# EAGLE design ChargeModule (EAGLE 9.6.2)
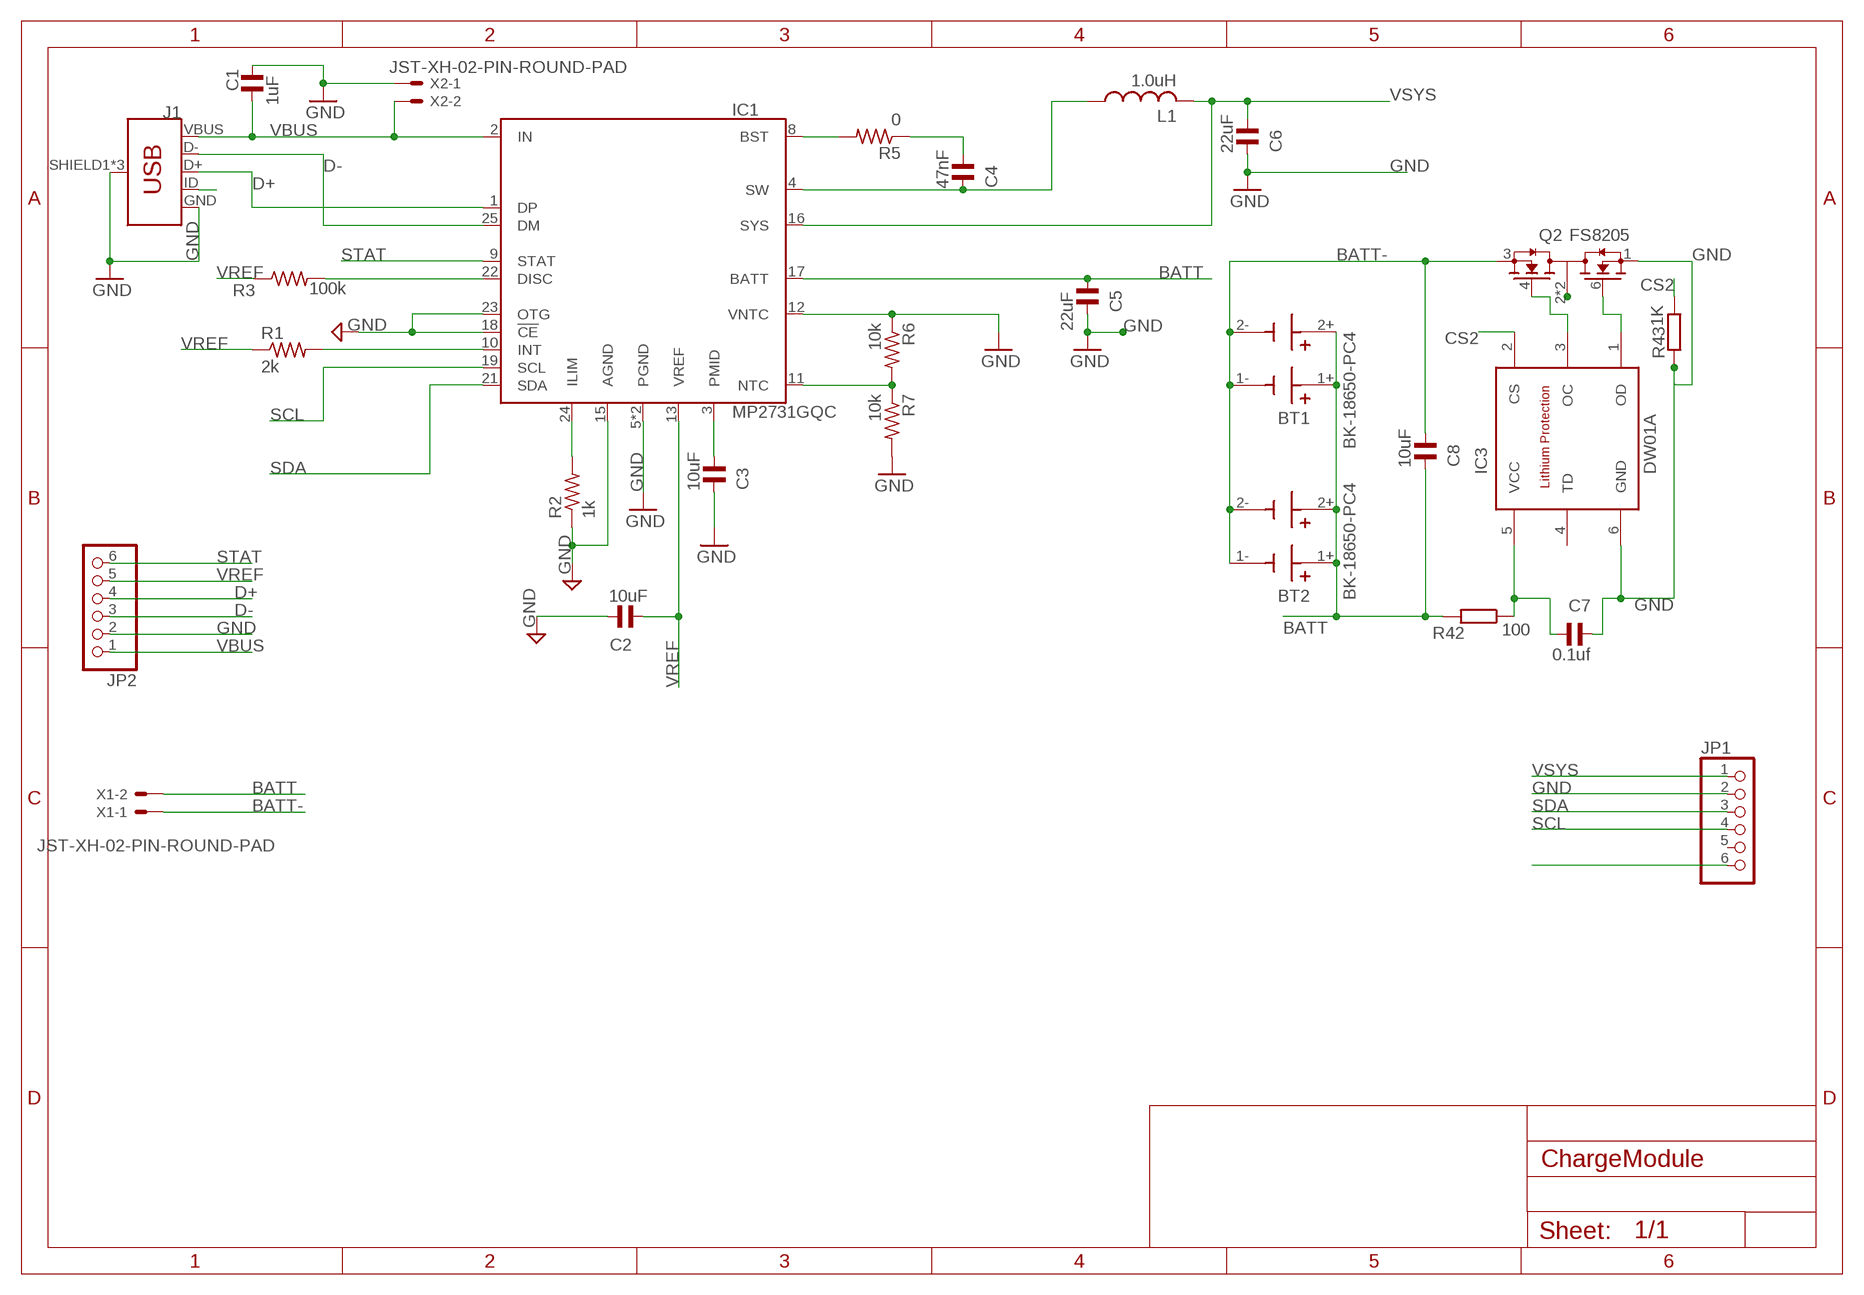
[diagram p0: schematic, sheet 1]

## Parts
BT1  BK-18650-PC4  [BAT_BK-18650-PC4]
BT2  BK-18650-PC4  [BAT_BK-18650-PC4]
C1  1uF  RC-MASTER-SMD_C_0805MP  [RC-MASTER-SMD_C0805MP]
C2  10uF  RC-MASTER-SMD_C_0805MP  [RC-MASTER-SMD_C0805MP]
C3  10uF  RC-MASTER-SMD_C_0805MP  [RC-MASTER-SMD_C0805MP]
C4  47nF  RC-MASTER-SMD_C_0805MP  [RC-MASTER-SMD_C0805MP]
C5  22uF  RC-MASTER-SMD_C_0805MP  [RC-MASTER-SMD_C0805MP]
C6  22uF  RC-MASTER-SMD_C_0805MP  [RC-MASTER-SMD_C0805MP]
C7  0.1uf  RC-MASTER-SMD_C_0805MP  [RC-MASTER-SMD_C0805MP]
C8  10uF  RC-MASTER-SMD_C_0805MP  [RC-MASTER-SMD_C0805MP]
IC1  MP2731GQC  [QFN-26-3.5]
IC3  DW01A  [SOT23-6]
J1  USB_MICRO-B_FEMALE-SMT  [USB-B-MICRO-SMD]
JP1  PINHD-1X6JSTXH  [JST-XH-06-PACKAGE-ROUND-PAD]
JP2  PINHD-1X6JSTXH  [JST-XH-06-PACKAGE-ROUND-PAD]
L1  1.0uH  L-USWE-TPC  [POWER-CHOKE_WE-TPC]
Q2  FS8205  [SOT95P280X145-6N]
R1  2k  R-US_M0805  [M0805]
R2  1k  R-US_M0805  [M0805]
R3  100k  R-US_M0805  [M0805]
R5  0  R-US_M0805  [M0805]
R6  10k  R-US_M0805  [M0805]
R7  10k  R-US_M0805  [M0805]
R42  100  R-EU_R0805  [R0805]
R43  1K  R-EU_R0805  [R0805]
X1  JST-XH-02-PIN-ROUND-PAD  [JST-XH-02-PACKAGE-ROUND-PAD]
X2  JST-XH-02-PIN-ROUND-PAD  [JST-XH-02-PACKAGE-ROUND-PAD]

## Nets
BATT: BT1.1+ BT1.2+ BT2.1+ BT2.2+ C5.1 C8.2 IC1.17(BATT) R42.2 X1.2
BATT-: BT1.1- BT1.2- BT2.1- BT2.2- C8.1 Q2.3(S2) X1.1
CS2: IC3.2(CS) R43.1
D+: IC1.1(DP) J1.D+ JP2.4
D-: IC1.25(DM) J1.D- JP2.3
GND: C1.2 C2.2 C3.2 C5.2 C6.2 C7.2 IC1.5(PGND) IC1.6(PGND) IC1.12(VNTC) IC1.15(AGND) IC1.18(!CE) IC1.23(OTG) IC3.6(GND) J1.GND J1.SHIELD1(SHIELD) J1.SHIELD2(SHIELD) J1.SHIELD3(SHIELD) JP1.2 JP2.2 Q2.1(S1) R2.1 R6.1 R7.2 R43.2 X2.1
N$2: IC1.24(ILIM) R2.2
N$3: IC1.10(INT) R1.2
N$7: J1.ID
N$9: IC1.22(DISC) R3.2
N$10: IC1.8(BST) R5.2
N$11: C3.1 IC1.3(PMID)
N$12: C4.1 R5.1
N$13: C4.2 IC1.4(SW) L1.1
N$15: IC1.11(NTC) R6.2 R7.1
N$20: JP1.6
N$52: Q2.2(D12) Q2.5(D12)
N$53: C7.1 IC3.5(VCC) R42.1
N$55: IC3.1(OD) Q2.6(G1)
N$56: IC3.3(OC) Q2.4(G2)
SCL: IC1.19(SCL) JP1.4
SDA: IC1.21(SDA) JP1.3
STAT: IC1.9(STAT) JP2.6
VBUS: C1.1 IC1.2(IN) J1.VBUS JP2.1 X2.2
VREF: C2.1 IC1.13(VREF) JP2.5 R1.1 R3.1
VSYS: C6.1 IC1.16(SYS) JP1.1 L1.2
Unconnected: IC3.4(TD) JP1.5

## Library data of the parts
BT1 BT2 = BK-18650-PC4:BK-18650-PC4: Battery Holder (Open) 18650 2 Cell PC Pin Check availability <https://pricing.snapeda.com/parts/BK-18650-PC4/MPD/view-part?ref=eda>; AVAILABILITY: In Stock; DESCRIPTION: Battery Holder (Open) 18650 2 Cell PC Pin; MF: MPD; MP: BK-18650-PC4; PACKAGE: None; PRICE: None; PURCHASE-URL: https://pricing.snapeda.com/search/part/BK-18650-PC4/?ref=eda
C1-C8 = 52101-101-REV-A_v16:RC-MASTER-SMD_C_: NON-POLARIZED CAP
IC1 = mp2731:MP2731; MARK: BMA__; MF: Monolithic Power; MPN: MP2731GQC-0000-Z
IC3 = DW01A:DW01A: Check availability <https://pricing.snapeda.com/parts/DW01A/Fortune%20Semiconductor/view-part?ref=eda>; AVAILABILITY: Not in stock; DESCRIPTION: One Cell Lithium-ion/Polymer Battery Protection IC; MF: Fortune Semiconductor; MP: DW01A; PACKAGE: SOT-23-6 Fortune Semiconductor; PRICE: None
J1 = SparkFun-Connectors:USB_MICRO-B: USB Type Micro-B Connector Male/female and PTH/SMT variants SparkFun Products: SparkFun microB USB Breakout <https://www.sparkfun.com/products/12035> SparkFun USB microB Plug Breakout <https://www.sparkfun.com/products/10031> SparkFun ESP8266 Thing <https://www.sparkfun.com/products/13231>; PROD_ID: CONN-11752
JP1 JP2 = pinhead:PINHD-1X6: PIN HEADER
L1 = rcl:L-US: INDUCTOR, American symbol; SPICEPREFIX: L
Q2 = FS8205:FS8205: Dual N Channel Enhancement Mode Power MOSFET Check availability <https://pricing.snapeda.com/parts/FS8205/Fortune%20Semiconductor/view-part?ref=eda>; AVAILABILITY: Not in stock; DESCRIPTION: Dual N-Channel Enhancement Mode Power MOSFET; MF: Fortune Semiconductor; MP: FS8205; PACKAGE: Package; PRICE: None
R1-R3 R5-R7 = adafruit:R-US_: RESISTOR, American symbol
R42 R43 = resistor:R-EU_: RESISTOR, European symbol
X1 X2 = Rembrandt Electronics - JST XH Connectors v1-0:JST-XH-02-PIN: JST XH Connector 2 Pin Wire to board connector. Pitch: 2,54 mm, (0.100") Number of pins: 2 Created by Rembrandt Electronics www.rembrandtelectronics.com

## Board
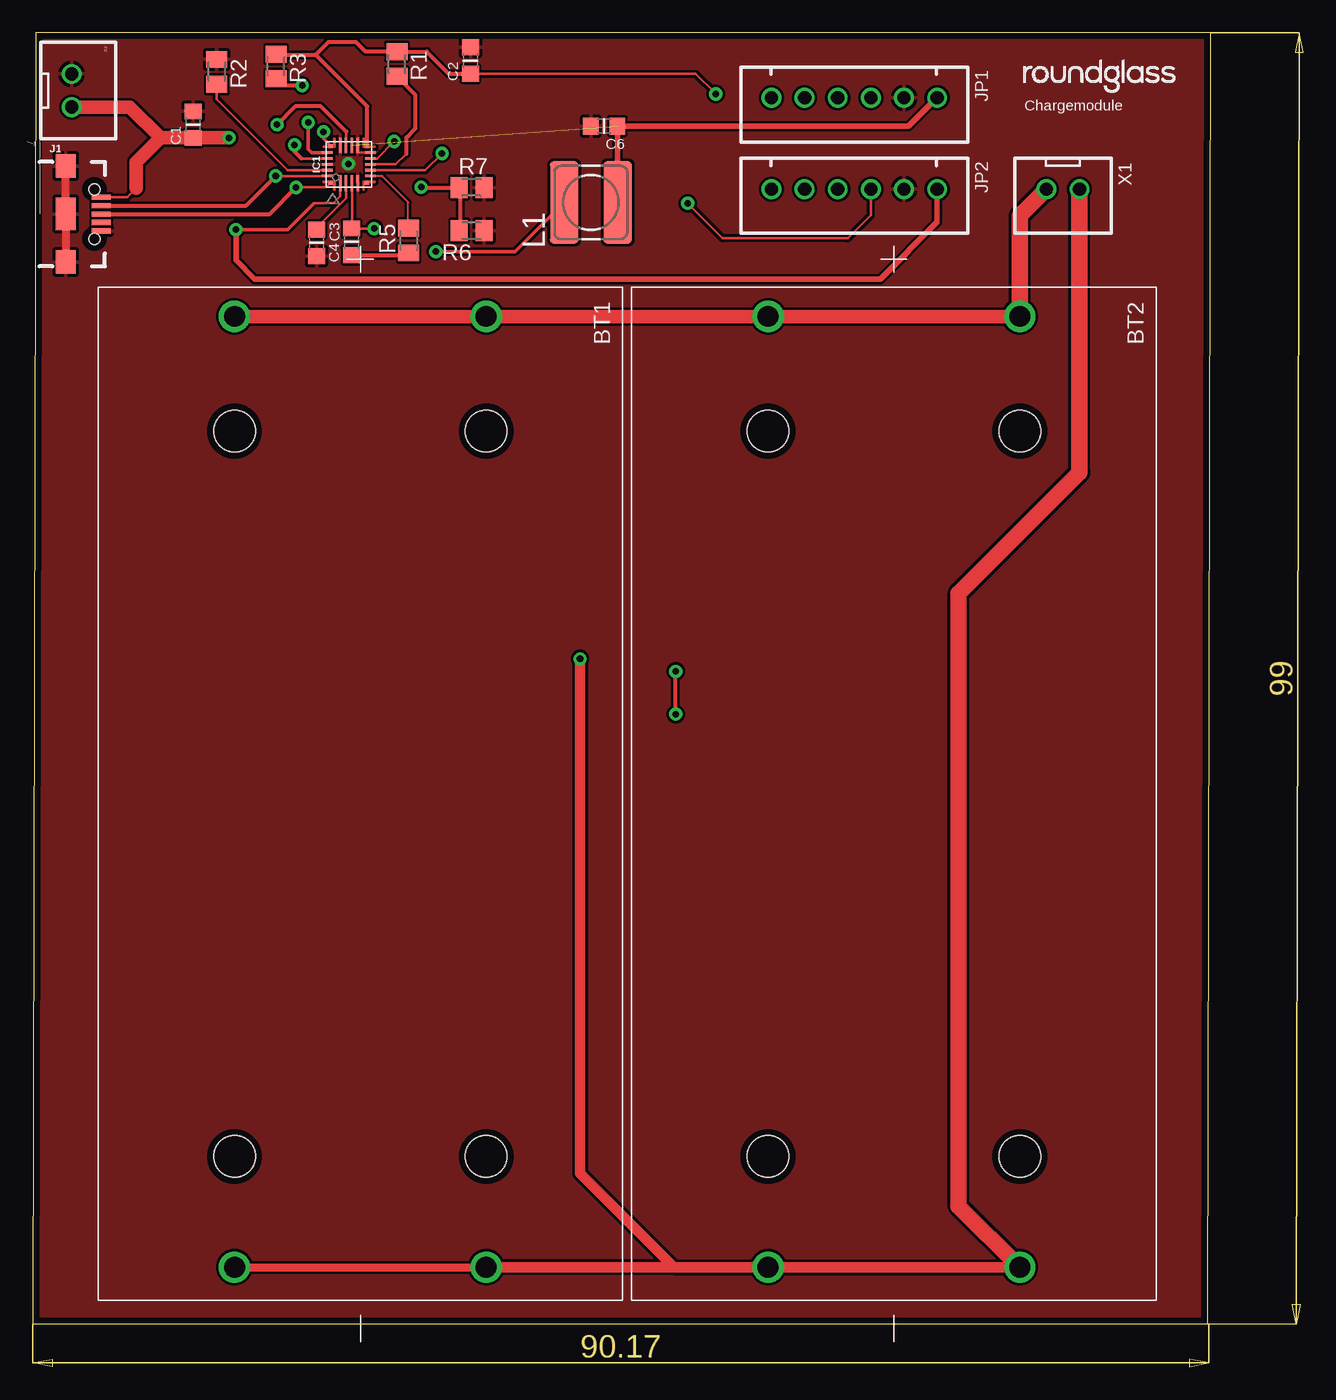
[diagram p1: board, top side]
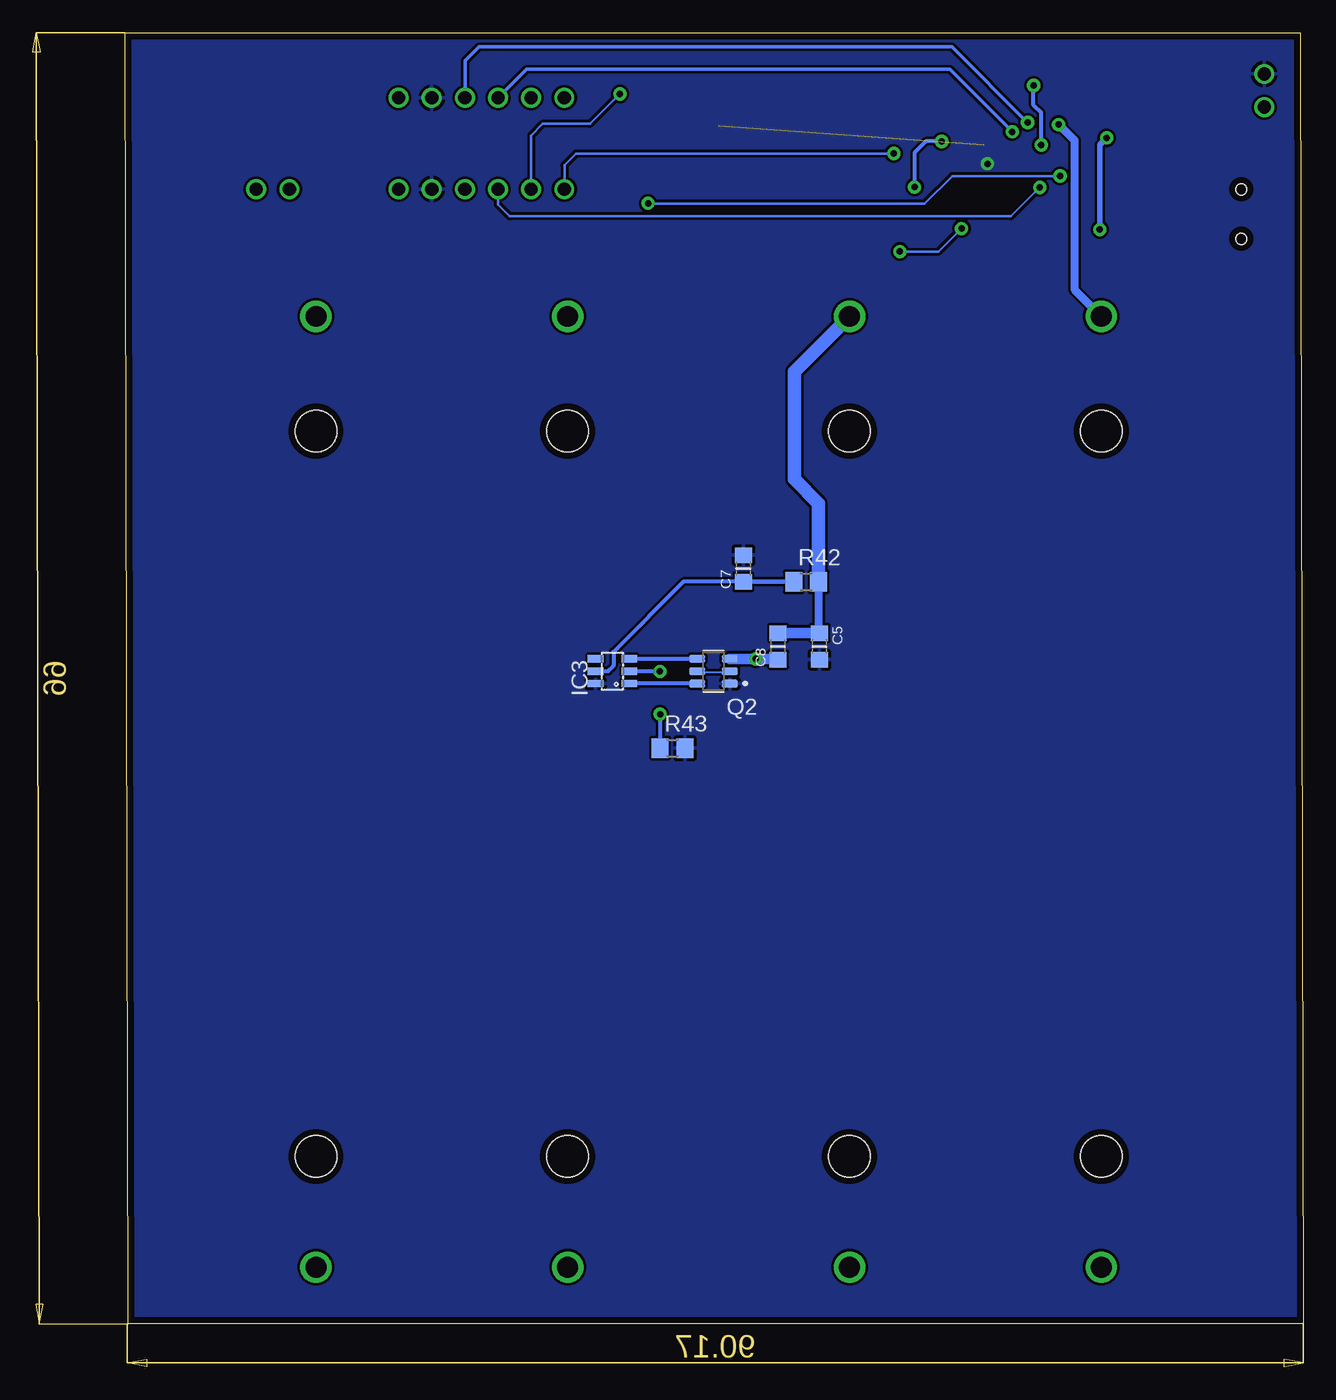
[diagram p2: board, bottom side, seen from below]

Size 90.32 x 99 mm. Coordinates in mm from the lower left corner, seen from the top.
Outline: 0,0 90.09,0 90.32,99 0.23,99 0,0
Copper layers (1*16): Top 0.035mm / dielectric 1.5mm / Bottom 0.035mm
Design rules "jotElectronics *": minimum track width 6mil, minimum drill 0.5mm, track to track 0.2mm, track to pad 0.2mm, pad to pad 0.2mm, via to via 0.2mm, smd to smd 0.2mm, copper to edge 0.5mm, drill to drill 0.5mm, minimum pad ring 10mil, minimum via ring 10mil, stop-mask expansion 4mil, vias tented up to drill 0mil, thermal gap 10mil

### Footprints (pad centres in the part's own frame; a part is rotated, then mirrored left to right if it is on the bottom)
BAT_BK-18650-PC4 = drill 1.6: 1+ -36.6,9.65; 1- 36.3,9.65; 2+ -36.6,-9.65; 2- 36.3,-9.65 | hole 3.2: -27.81,-9.65; -27.81,9.65; 27.81,-9.65; 27.81,9.65
RC-MASTER-SMD_C0805MP = smd 1.2 x 1.3: 1 -1.016,0; 2 1.016,0
QFN-26-3.5 = smd 0.3 x 0.3: 1 -1.4,1.4; 6 -1.4,-1.4; 13 1.4,-1.4; 19 1.4,1.4 | smd 1.2 x 0.2: 2 -1.45,0.675; 3 -1.45,0.225; 4 -1.45,-0.225; 5 -1.45,-0.675; 15 1.45,-0.675; 16 1.45,-0.225; 17 1.45,0.225; 18 1.45,0.675 | smd 0.2 x 0.8: 8 -0.9,-1.65; 9 -0.45,-1.65; 10 0,-1.65; 11 0.45,-1.65; 12 0.9,-1.65; 21 0.9,1.65; 22 0.45,1.65; 23 0,1.65; 24 -0.45,1.65; 25 -0.9,1.65
SOT23-6 = smd 0.55 x 1.2: 1 -0.95,-1.3; 2 0,-1.3; 3 0.95,-1.3; 4 0.95,1.3; 5 0,1.3; 6 -0.95,1.3
USB-B-MICRO-SMD = smd 1.45 x 0.4: D+ 2.725,0; D- 2.725,0.65; GND 2.725,-1.3; ID 2.725,-0.65; VBUS 2.725,1.3 | smd 1.5 x 1.8: SHIELD1 0,3.685; SHIELD2 0,-3.685 | smd 1.5 x 2.5: SHIELD3 0,0 | hole 0.85: 2.2,1.9; 2.2,-1.9
JST-XH-06-PACKAGE-ROUND-PAD = drill 1.016: 1 -6.35,0; 2 -3.81,0; 3 -1.27,0; 4 1.27,0; 5 3.81,0; 6 6.35,0
POWER-CHOKE_WE-TPC = smd 6.3 x 2.2: 1 0,2.05; 2 0,-2.05
SOT95P280X145-6N = smd 1.21 x 0.59: 1 -1.255,0.95; 2 -1.255,0; 3 -1.255,-0.95; 4 1.255,-0.95; 5 1.255,0; 6 1.255,0.95
M0805 = smd 1.3 x 1.6: 1 -0.95,0; 2 0.95,0
R0805 = smd 1.3 x 1.5: 1 -0.95,0; 2 0.95,0
JST-XH-02-PACKAGE-ROUND-PAD = drill 1.016: 1 -1.27,0; 2 1.27,0

### Placement (x,y rotation side)
BT1  25.13,40.64 270 top
BT2  66.04,40.64 270 top
C1  12.32,91.95 90 top
C2  33.57,96.86 90 top
C3  21.77,82.88 270 top
C4  24.46,82.96 90 top
C5  37.08,51.94 270 bottom
C6  43.81,91.84 180 top
C7  42.93,57.91 90 bottom
C8  40.26,51.94 90 bottom
IC1  24.26,88.9 90 top
IC3  52.96,50.04 90 bottom
J1  2.54,85.09 0 top
JP1  63,94 180 top
JP2  63,87 180 top
L1  42.8,85.98 90 top
Q2  45.21,50.04 180 bottom
R1  27.93,96.59 270 top
R2  14.12,95.99 270 top
R3  18.67,96.41 270 top
R5  28.83,83.06 90 top
R6  33.66,83.82 180 top
R7  33.66,87.12 0 top
R42  38.1,56.9 0 bottom
R43  48.34,44.14 0 bottom
X1  79,87 180 top
X2  2.99,94.56 270 top

### Tracks (layer width: path | path; a pad name or v marks a point on that pad's centre or on a via)
BATT  (via drill 0.5)
  Top 0.203: 24.04,91.4 24.03,91.4 IC1.17
  Top 0.305: v18.75,91.95 20.14,93.35 22.09,93.35 24.04,91.4
  Top 1.016: BT1.2+ BT1.1+ BT2.2+ BT2.1+
  Top 1.27: BT2.1+ 75.69,84.96 X1.2
  Bottom 0.152: 37.19,53.03 40.23,53.03 C8.2 | 37.19,53.03 37.19,56.84 R42.2 | 37.19,53.03 C5.1
  Bottom 0.61: R42.2 37.15,53.02 C5.1 | BT1.2+ 17.54,79.3 17.54,90.74 v18.75,91.95
  Bottom 0.813: C5.1 C8.2
  Bottom 1.016: R42.2 37.15,62.9 39,64.76 39,73.02 BT1.1+
BATT-  (via drill 0.5)
  Top 0.61: BT1.2- BT1.1-
  Top 0.813: 49.17,4.34 BT1.1- | BT2.1- BT2.2- 49.17,4.34 | v41.97,50.98 41.97,11.54 49.17,4.34
  Top 1.27: BT2.1- 71,9.03 71,56 80.27,65.27 X1.1
  Bottom 0.813: C8.1 40.32,50.99 v41.98,50.99 | v41.97,50.98 v41.98,50.99 | v41.98,50.99 Q2.3
CS2  (via drill 0.5)
  Top 0.152: 49.31,50 v49.31,50.02
  Top 0.305: v49.31,46.75 49.31,49.99 49.31,50
  Bottom 0.305: v49.31,46.75 49.31,44.16 R43.1 | v49.31,50.02 51.65,50.02 IC3.2
D+  (via drill 0.5)
  Top 0.203: IC1.1 22.49,87.13 v20.2,87.13
  Top 0.305: J1.D+ 18.16,85.09 v20.2,87.13
  Bottom 0.203: v20.2,87.13 22.41,84.92 60.83,84.92 61.73,85.82 JP2.4
D-  (via drill 0.5)
  Top 0.203: IC1.25 22.6,88.01 v18.63,88.01 | v50.23,85.91 52.91,83.23 62.5,83.23 64.27,85 JP2.3
  Top 0.305: J1.D- 16.36,85.74 v18.63,88.01
  Bottom 0.203: v18.63,88.01 26.9,88.01 29.03,85.88 50.2,85.88 v50.23,85.91
GND  (via drill 0.5)
  Top 0.152: IC1.12 25,89.8 24.93,89.87 IC1.15
  Top 0.61: J1.SHIELD2 J1.SHIELD3 J1.SHIELD1
  other vias: 24.21,88.94
  pour Bottom: -0.01,99 -0.01,0 90.17,0 90.17,99
  pour Top: 0,99 0,0 90.17,0 90.17,99
N$2
  Top 0.203: IC1.24 19.56,88.45 14.12,93.89 R2.2
N$3
  Top 0.203: IC1.10 27.85,88.9 28.66,89.71
  Top 0.305: 28.66,89.71 28.66,90.96 29.34,91.64 29.34,94.24 R1.2
N$9  (via drill 0.5)
  Top 0.203: 20.61,89.36 20.62,89.35 IC1.22
  Top 0.305: R3.2 19.18,94.94 v20.67,94.94 | 20.61,89.36 20.08,89.89 v20.08,90.39
  Bottom 0.305: v20.67,94.94 20.67,93.42 20.08,92.84 v20.08,90.39
N$10
  Top 0.152: IC1.8 26.8,88 28.8,86 28.8,84.12 R5.2
N$11
  Top 0.203: IC1.3 24.04,86.31 21.77,84.03 C3.1
N$12
  Top 0.305: C4.1 28.66,81.94 R5.1
N$13  (via drill 0.5)
  Top 0.2: IC1.4 24.48,84
  Top 0.203: C4.2 v26.19,83.97
  Top 0.254: 24.48,84 C4.2 | L1.1 36.98,82.21 v30.92,82.21
  Bottom 0.203: v26.19,83.97 27.95,82.21 v30.92,82.21
N$15  (via drill 0.5)
  Top 0.152: 32.77,83.82 R6.2
  Top 0.203: IC1.11 26.41,89.35 v27.72,90.66
  Top 0.305: 32.77,83.82 32.77,87.06 R7.1 29.84,87.12 v29.8,87.16
  Bottom 0.305: v27.72,90.66 28.92,90.66 29.8,89.78 v29.8,87.16
N$52
  Bottom 0.152: Q2.2 44.04,49.99 46.33,49.99 Q2.5
N$53
  Bottom 0.152: R42.1 39.17,56.84 42.82,56.84 C7.1
  Bottom 0.305: IC3.5 53.29,50.04 52.88,50.44 52.88,51.51 47.5,56.9 C7.1 R42.1
N$55
  Bottom 0.305: Q2.6 IC3.1
N$56
  Bottom 0.305: Q2.4 IC3.3
SCL  (via drill 0.5)
  Top 0.254: IC1.19 22.3,90.86 v22.3,91.4
  Bottom 0.254: v22.3,91.4 27.1,96.2 58,96.2 58.73,96.2 59.53,96.2 JP1.4
SDA  (via drill 0.5)
  Top 0.254: IC1.21 21.4,89.8 21.13,90.07 v21.13,92.11
  Bottom 0.254: v21.13,92.11 26.93,97.91 63.19,97.91 64.27,96.83 JP1.3
STAT  (via drill 0.5)
  Top 0.203: IC1.9 30.11,88.45 v31.39,89.73
  Bottom 0.203: v31.39,89.73 55.75,89.73 56.65,88.83 JP2.6
VBUS  (via drill 0.5)
  Top 0.203: IC1.2 23.58,86.45 23.07,85.94 21.62,85.94 21.56,85.88 | J1.VBUS 7.26,86.39 7.94,87.06
  Top 0.254: v15.59,83.9 15.61,83.88 19.57,83.88 21.56,85.88
  Top 0.406: C1.1 v15.06,90.93 | v15.59,83.9 15.59,81.55 17.04,80.1 65,80.1 69.35,84.45 JP2.1
  Top 0.508: 9.81,90.93 C1.1
  Top 1.016: X2.2 7.45,93.29 9.81,90.93 | 9.81,90.93 v15.06,90.93 | 7.94,87.06 7.94,89.06 9.81,90.93
  Bottom 0.406: v15.06,90.93 15.59,90.4 v15.59,83.9
VREF  (via drill 0.5)
  Top 0.203: C2.1 50.84,95.84 v52.38,94.3
  Top 0.305: IC1.13 25.65,93.34 21.7,97.3 18.73,97.3 R3.1 | 21.71,97.3 22.71,98.3 24.77,98.3 25.52,97.54 R1.1 30.21,97.54 31.91,95.84 C2.1
  Bottom 0.203: v52.38,94.3 54.68,92 58.3,92 59.19,91.11 JP2.5
VSYS  (1 unrouted)
  Top 0.406: JP1.1 69.33,94 67.17,91.84 45.01,91.84 | C6.1 45.01,91.84 | 45.01,91.84 44.85,91.68 L1.2

### Text on the board
tNames: Chargemodule